# Altium schematic sheet Sheet_1_2021-12-20.schdoc
size 49 x 28 mm
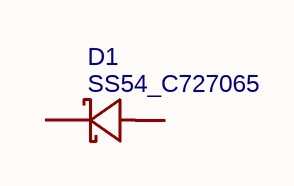
[diagram p0: Sheet_1_2021-12-20.schdoc]

## Parts
D1  SS54_C727065  [SMA_L4.3-W2.6-LS5.0-RD]

## Nets

Not connected (* = marked no-connect by the designer): D1 1 2

## Library data of the parts
D1 = SS54_C727065: BOM_Manufacturer: TWGMC; BOM_Manufacturer Part: SS54; Contributor: LCSC; BOM_Supplier: LCSC; BOM_Supplier Part: C727065; BOM_JLCPCB Part Class: Extended Part; spicePre: D; spiceSymbolName: SS54_C727065